# Altium schematic sheet eps_can_transceiver.SchDoc
size A4
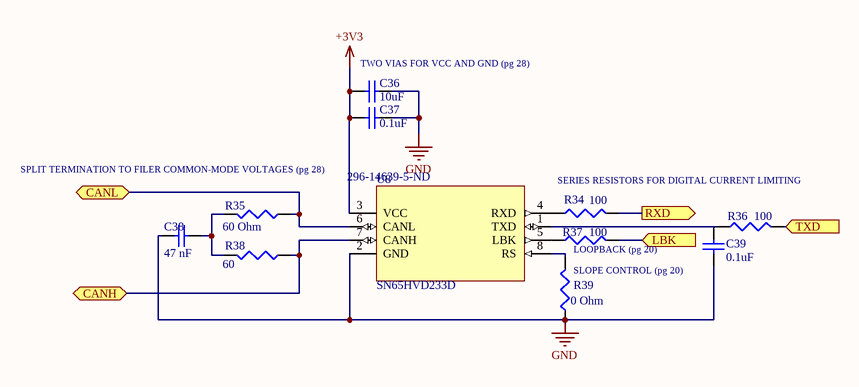
[diagram p0: eps_can_transceiver.SchDoc]

## Parts
C36  value 10uF  [1608[0603]]  (hidden comment: Cap Semi)
C37  value 0.1uF  [1608[0603]]  (hidden comment: Cap Semi)
C38  value 47 nF  [1608[0603]]  (hidden comment: Ceramic)
C39  0.1uF  [1608[0603]]
R34  value 100  [J1-0603]
R35  value 60 Ohm  [J1-0603]  (hidden comment: 0603)
R36  value 100  [J1-0603]
R37  100  [J1-0603]
R38  value 60  [J1-0603]  (hidden comment: 0603)
R39  value 0 Ohm  [J1-0603]
U8  SN65HVD233D  Supplier Part Number 1: 296-14639-5-ND  [SOIC127P500X600-8N]

## Ports
CANH (bidir), CANL (bidir), LBK (in), RXD (out), TXD (in)

## Nets
+3V3: C36.2 C37.2 U8.3(VCC)
GND: C36.1 C37.1 C38.1 C39.1 R39.1 U8.2(GND)
CANH: R38.1 U8.7(CANH) ; port CANH
CANL: R35.1 U8.6(CANL) ; port CANL
LBK: R37.2 ; port LBK
RXD: R34.2 ; port RXD
TXD: R36.2 ; port TXD
NetC38_2: C38.2 R35.2 R38.2
NetC39_2: C39.2 R36.1 U8.1(TXD)
NetR34_1: R34.1 U8.4(RXD)
NetR37_1: R37.1 U8.5(LBK)
NetR39_2: R39.2 U8.8(RS)

## Notes on the sheet
- (near C36) TWO VIAS FOR VCC AND GND (pg 28)
- SPLIT TERMINATION TO FILER COMMON-MODE VOLTAGES (pg 28)
- SERIES RESISTORS FOR DIGITAL CURRENT LIMITING
- (near R39) SLOPE CONTROL (pg 20)
- (near R37) LOOPBACK (pg 20)

## Library data of the parts
C36-C39 = Cap Semi: Capacitor (Semiconductor SIM Model); Published: 8-Jun-2000; LatestRevisionDate: 29-May-2009; LatestRevisionNote: IPC-7351 Footprint Added.; PackageReference: C1206; Publisher: Altium Limited; PackageDescription: Chip Capacitor
  C39: Value: 0.1uF
R34-R39 = Res3: Resistor; Published: 8-Jun-2000; LatestRevisionDate: 29-May-2009; LatestRevisionNote: IPC-7351 Footprint Added.; PackageReference: J1-0603; Publisher: Altium Limited; PackageDescription: Chip Resistor
  R37: Value: 100
U8 = SN65HVD233D: 3.3V CAN Transceiver with Standby Mode, Loop-back 8-SOIC -40 to 125; MF: Texas Instruments; MP: SN65HVD233D; Package: SOIC-8 Texas Instruments; Availability: Good; SnapEDA_Link: https://www.snapeda.com/parts/SN65HVD233D/Texas%20Instruments/view-part/?ref=snap; Price: 2.39 USD; Value: *; Supplier 1: Digi-Key